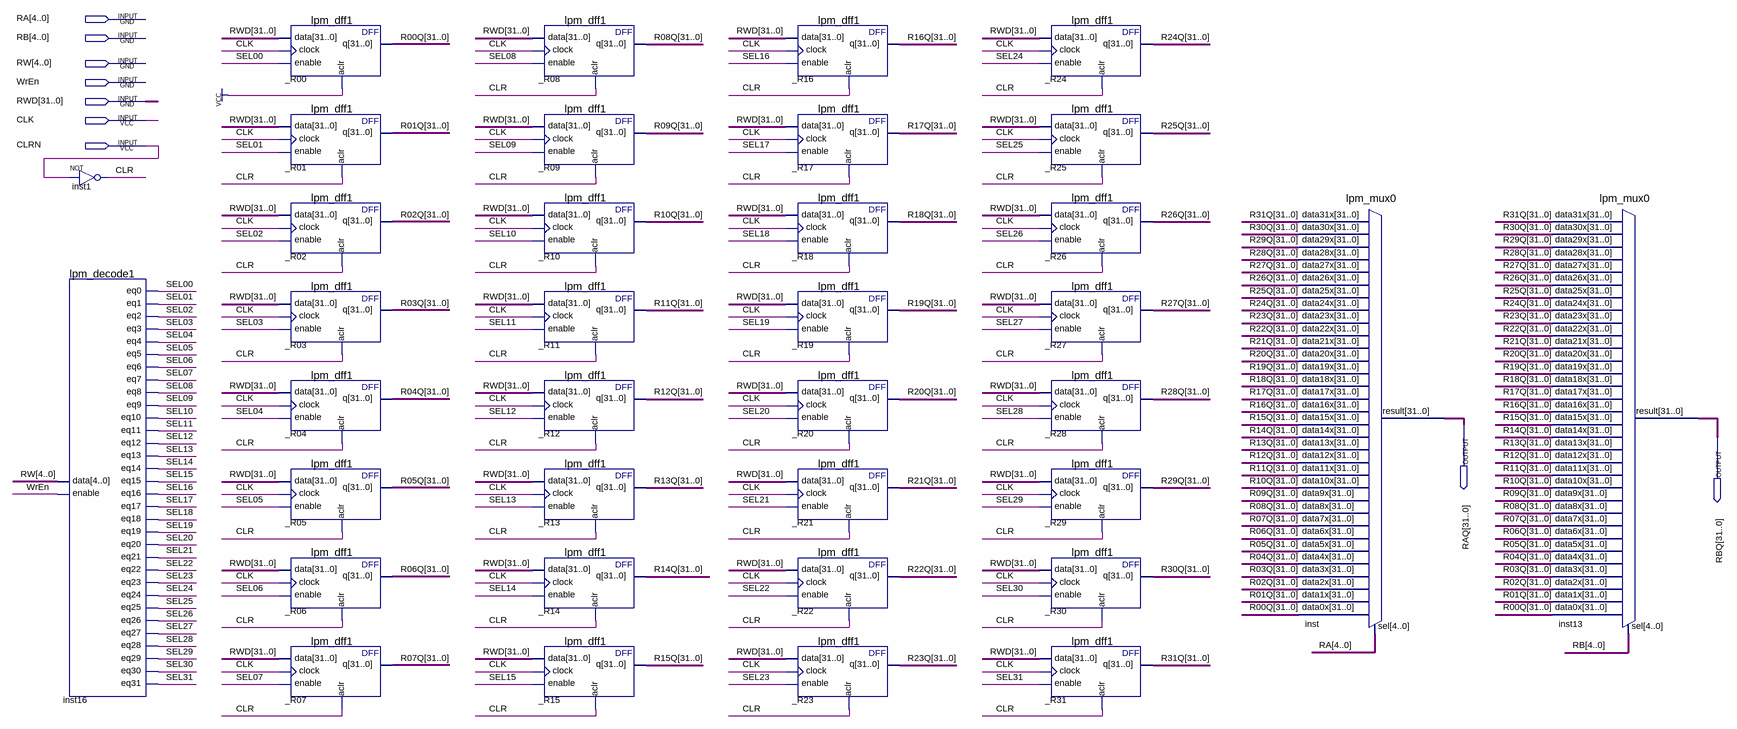
[diagram p0: schematic sheet]
// Quartus schematic GPRs.bdf as structural Verilog: 36 symbols, 9 pins
module GPRs (
  input  [4:0] RA,
  input  [4:0] RB,
  input  [4:0] RW,
  input  WrEn,
  input  [31:0] RWD,
  input  CLK,
  input  CLRN,
  output [31:0] RAQ,
  output [31:0] RBQ
);

  wire CLR, SEL00, SEL01, SEL02, SEL03, SEL04, SEL05, SEL06, SEL07, SEL08, SEL09, SEL10, SEL11, SEL12, SEL13,
       SEL14, SEL15, SEL16, SEL17, SEL18, SEL19, SEL20, SEL21, SEL22, SEL23, SEL24, SEL25, SEL26, SEL27,
       SEL28, SEL29, SEL30, SEL31;
  wire [31:0] R00Q, R01Q, R02Q, R03Q, R04Q, R05Q, R06Q, R07Q, R08Q, R09Q, R10Q, R11Q, R12Q, R13Q, R14Q, R15Q,
       R16Q, R17Q, R18Q, R19Q, R20Q, R21Q, R22Q, R23Q, R24Q, R25Q, R26Q, R27Q, R28Q, R29Q, R30Q, R31Q;

  not inst1 (CLR, CLRN);
  lpm_decode1 inst16 (
    .data(RW), .enable(WrEn), .eq0(SEL00), .eq1(SEL01), .eq2(SEL02), .eq3(SEL03), .eq4(SEL04), .eq5(SEL05),
    .eq6(SEL06), .eq7(SEL07), .eq8(SEL08), .eq9(SEL09), .eq10(SEL10), .eq11(SEL11), .eq12(SEL12),
    .eq13(SEL13), .eq14(SEL14), .eq15(SEL15), .eq16(SEL16), .eq17(SEL17), .eq18(SEL18), .eq19(SEL19),
    .eq20(SEL20), .eq21(SEL21), .eq22(SEL22), .eq23(SEL23), .eq24(SEL24), .eq25(SEL25), .eq26(SEL26),
    .eq27(SEL27), .eq28(SEL28), .eq29(SEL29), .eq30(SEL30), .eq31(SEL31));
  lpm_dff1 _R00 (.data(RWD), .clock(CLK), .enable(SEL00), .aclr(1'b1), .q(R00Q));
  lpm_dff1 _R01 (.data(RWD), .clock(CLK), .enable(SEL01), .aclr(CLR), .q(R01Q));
  lpm_dff1 _R02 (.data(RWD), .clock(CLK), .enable(SEL02), .aclr(CLR), .q(R02Q));
  lpm_dff1 _R03 (.data(RWD), .clock(CLK), .enable(SEL03), .aclr(CLR), .q(R03Q));
  lpm_dff1 _R04 (.data(RWD), .clock(CLK), .enable(SEL04), .aclr(CLR), .q(R04Q));
  lpm_dff1 _R05 (.data(RWD), .clock(CLK), .enable(SEL05), .aclr(CLR), .q(R05Q));
  lpm_dff1 _R06 (.data(RWD), .clock(CLK), .enable(SEL06), .aclr(CLR), .q(R06Q));
  lpm_dff1 _R07 (.data(RWD), .clock(CLK), .enable(SEL07), .aclr(CLR), .q(R07Q));
  lpm_dff1 _R08 (.data(RWD), .clock(CLK), .enable(SEL08), .aclr(CLR), .q(R08Q));
  lpm_dff1 _R09 (.data(RWD), .clock(CLK), .enable(SEL09), .aclr(CLR), .q(R09Q));
  lpm_dff1 _R10 (.data(RWD), .clock(CLK), .enable(SEL10), .aclr(CLR), .q(R10Q));
  lpm_dff1 _R11 (.data(RWD), .clock(CLK), .enable(SEL11), .aclr(CLR), .q(R11Q));
  lpm_dff1 _R12 (.data(RWD), .clock(CLK), .enable(SEL12), .aclr(CLR), .q(R12Q));
  lpm_dff1 _R13 (.data(RWD), .clock(CLK), .enable(SEL13), .aclr(CLR), .q(R13Q));
  lpm_dff1 _R14 (.data(RWD), .clock(CLK), .enable(SEL14), .aclr(CLR), .q(R14Q));
  lpm_dff1 _R15 (.data(RWD), .clock(CLK), .enable(SEL15), .aclr(CLR), .q(R15Q));
  lpm_dff1 _R16 (.data(RWD), .clock(CLK), .enable(SEL16), .aclr(CLR), .q(R16Q));
  lpm_dff1 _R17 (.data(RWD), .clock(CLK), .enable(SEL17), .aclr(CLR), .q(R17Q));
  lpm_dff1 _R18 (.data(RWD), .clock(CLK), .enable(SEL18), .aclr(CLR), .q(R18Q));
  lpm_dff1 _R19 (.data(RWD), .clock(CLK), .enable(SEL19), .aclr(CLR), .q(R19Q));
  lpm_dff1 _R20 (.data(RWD), .clock(CLK), .enable(SEL20), .aclr(CLR), .q(R20Q));
  lpm_dff1 _R21 (.data(RWD), .clock(CLK), .enable(SEL21), .aclr(CLR), .q(R21Q));
  lpm_dff1 _R22 (.data(RWD), .clock(CLK), .enable(SEL22), .aclr(CLR), .q(R22Q));
  lpm_dff1 _R23 (.data(RWD), .clock(CLK), .enable(SEL23), .aclr(CLR), .q(R23Q));
  lpm_dff1 _R24 (.data(RWD), .clock(CLK), .enable(SEL24), .aclr(CLR), .q(R24Q));
  lpm_dff1 _R25 (.data(RWD), .clock(CLK), .enable(SEL25), .aclr(CLR), .q(R25Q));
  lpm_dff1 _R26 (.data(RWD), .clock(CLK), .enable(SEL26), .aclr(CLR), .q(R26Q));
  lpm_dff1 _R27 (.data(RWD), .clock(CLK), .enable(SEL27), .aclr(CLR), .q(R27Q));
  lpm_dff1 _R28 (.data(RWD), .clock(CLK), .enable(SEL28), .aclr(CLR), .q(R28Q));
  lpm_dff1 _R29 (.data(RWD), .clock(CLK), .enable(SEL29), .aclr(CLR), .q(R29Q));
  lpm_dff1 _R30 (.data(RWD), .clock(CLK), .enable(SEL30), .aclr(CLR), .q(R30Q));
  lpm_dff1 _R31 (.data(RWD), .clock(CLK), .enable(SEL31), .aclr(CLR), .q(R31Q));
  lpm_mux0 inst (
    .data31x(R31Q), .data30x(R30Q), .data29x(R29Q), .data28x(R28Q), .data27x(R27Q), .data26x(R26Q),
    .data25x(R25Q), .data24x(R24Q), .data23x(R23Q), .data22x(R22Q), .data21x(R21Q), .data20x(R20Q),
    .data19x(R19Q), .data18x(R18Q), .data17x(R17Q), .data16x(R16Q), .data15x(R15Q), .data14x(R14Q),
    .data13x(R13Q), .data12x(R12Q), .data11x(R11Q), .data10x(R10Q), .data9x(R09Q), .data8x(R08Q),
    .data7x(R07Q), .data6x(R06Q), .data5x(R05Q), .data4x(R04Q), .data3x(R03Q), .data2x(R02Q), .data1x(R01Q),
    .data0x(R00Q), .sel(RA), .result(RAQ));
  lpm_mux0 inst13 (
    .data31x(R31Q), .data30x(R30Q), .data29x(R29Q), .data28x(R28Q), .data27x(R27Q), .data26x(R26Q),
    .data25x(R25Q), .data24x(R24Q), .data23x(R23Q), .data22x(R22Q), .data21x(R21Q), .data20x(R20Q),
    .data19x(R19Q), .data18x(R18Q), .data17x(R17Q), .data16x(R16Q), .data15x(R15Q), .data14x(R14Q),
    .data13x(R13Q), .data12x(R12Q), .data11x(R11Q), .data10x(R10Q), .data9x(R09Q), .data8x(R08Q),
    .data7x(R07Q), .data6x(R06Q), .data5x(R05Q), .data4x(R04Q), .data3x(R03Q), .data2x(R02Q), .data1x(R01Q),
    .data0x(R00Q), .sel(RB), .result(RBQ));
endmodule
